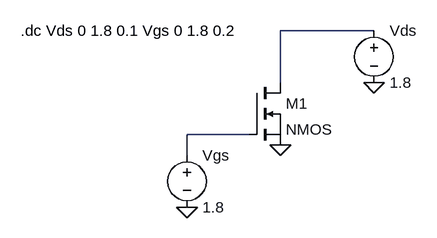
[diagram p0: schematic VI characteristics of Discrete NMOS.asc]
VI characteristics of Discrete NMOS.asc, the LTspice schematic file:
Version 4
SHEET 1 880 680
WIRE 368 48 224 48
WIRE 224 128 224 48
WIRE 176 208 80 208
WIRE 80 240 80 208
FLAG 368 128 0
FLAG 80 320 0
FLAG 224 224 0
SYMBOL nmos 176 128 R0
SYMATTR InstName M1
SYMBOL voltage 368 32 R0
WINDOW 123 0 0 Left 0
WINDOW 39 0 0 Left 0
SYMATTR InstName Vds
SYMATTR Value 1.8
SYMBOL voltage 80 224 R0
WINDOW 123 0 0 Left 0
WINDOW 39 24 124 Left 2
SYMATTR InstName Vgs
SYMATTR Value 1.8
TEXT -176 48 Left 2 !.dc Vds 0 1.8 0.1 Vgs 0 1.8 0.2

The netlist it stands for:
* VI characteristics of Discrete NMOS.asc
M1 N001 N002 0 0 NMOS
Vds N001 0 1.8
Vgs N002 0 1.8
.model NMOS NMOS
.model PMOS PMOS
.lib standard.mos
.dc Vds 0 1.8 0.1 Vgs 0 1.8 0.2
.backanno
.end